# Altium schematic sheet 04_Mechanical.SchDoc: Mechanicals
size A; Revision: A; SheetNumber: 4; SheetTotal: 4; ECE315_Project_Name: ECE453 Base Project
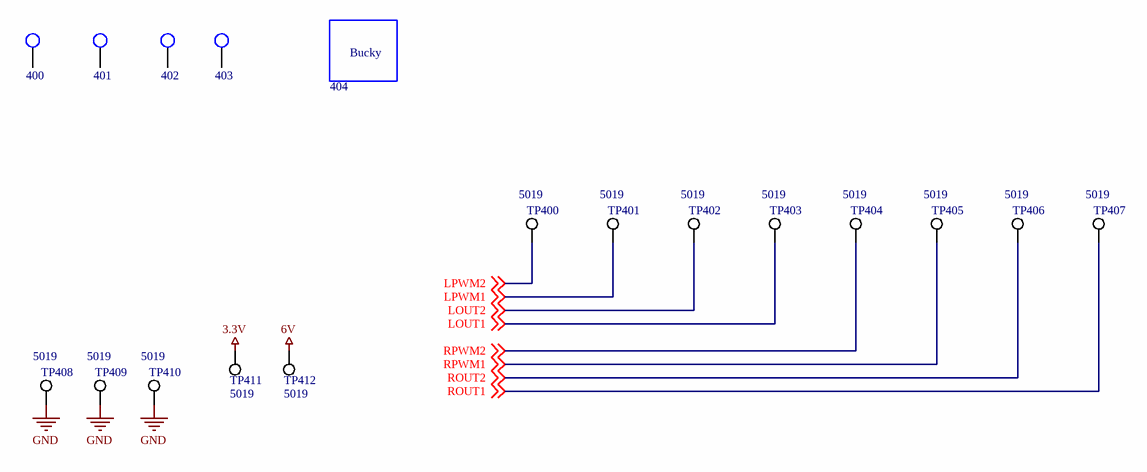
[diagram p0: 04_Mechanical.SchDoc]

## Parts
400  MHOLE_2_55MM  [MHOLE_2_55MM]  (value not drawn)
401  MHOLE_2_55MM  [MHOLE_2_55MM]  (value not drawn)
402  MHOLE_2_55MM  [MHOLE_2_55MM]  (value not drawn)
403  MHOLE_2_55MM  [MHOLE_2_55MM]  (value not drawn)
404  Bucky  [WalkingBucky]  (value not drawn)  (no BOM)
TP400  5019  [KSTN-5019_V]
TP401  5019  [KSTN-5019_V]
TP402  5019  [KSTN-5019_V]
TP403  5019  [KSTN-5019_V]
TP404  5019  [KSTN-5019_V]
TP405  5019  [KSTN-5019_V]
TP406  5019  [KSTN-5019_V]
TP407  5019  [KSTN-5019_V]
TP408  5019  [KSTN-5019_V]
TP409  5019  [KSTN-5019_V]
TP410  5019  [KSTN-5019_V]
TP411  5019  [KSTN-5019_V]
TP412  5019  [KSTN-5019_V]

## Nets
3.3V: TP411.1
6V: TP412.1
GND: TP408.1 TP409.1 TP410.1
LOUT1: TP403.1 ; off-sheet LOUT1
LOUT2: TP402.1 ; off-sheet LOUT2
LPWM1: TP401.1 ; off-sheet LPWM1
LPWM2: TP400.1 ; off-sheet LPWM2
ROUT1: TP407.1 ; off-sheet ROUT1
ROUT2: TP406.1 ; off-sheet ROUT2
RPWM1: TP405.1 ; off-sheet RPWM1
RPWM2: TP404.1 ; off-sheet RPWM2

Not connected (* = marked no-connect by the designer): 400 1; 401 1; 402 1; 403 1

## Notes on the sheet
- Title:
- Size:
- A
- Project
- Rev:
- Sheet:
- of
- College of Engineering
- 1415 Engineering Drive
- Madison, WI 53706

## Library data of the parts
400-403 = MHOLE_2_55MM: Mounting Holde; Manufacturer Part Number: UW MTHOLE
404 = Bucky: Bucky Badger Image; Manufacturer Part Number: UW Bucky
TP400-TP412 = CMP-1672-00008-1: Test Point, 1 Position SMD, RoHS, Tape and Reel; ComponentLink1Description: Manufacturer URL; Package Quantity: 1000; DatasheetVersion: 03/2014; Packaging: Tape and Reel; ComponentLink2URL: http://www.keyelco.com/product-pdf.cfm?p=1357; ComponentLink1URL: http://www.keyelco.com/; Mount: Surface Mount; Contact Plating: Silver; PackageDescription: 1-Pin Surface Mount Device, Body 3.81 x 2.03 mm; Pins: 1; RoHSCompliant: True; Mounting Technology: Surface Mount; ComponentLink2Description: Datasheet; PackageReference: 5019; Supplier: Digikey; Supplier Part Number: 36-5019DKR-ND